# Altium schematic sheet Index.SchDoc: Access Control
size A; DrawnBy: Q.Thang & T.Khoa; Revision: V1.0.1; SheetNumber: 2; SheetTotal: 16
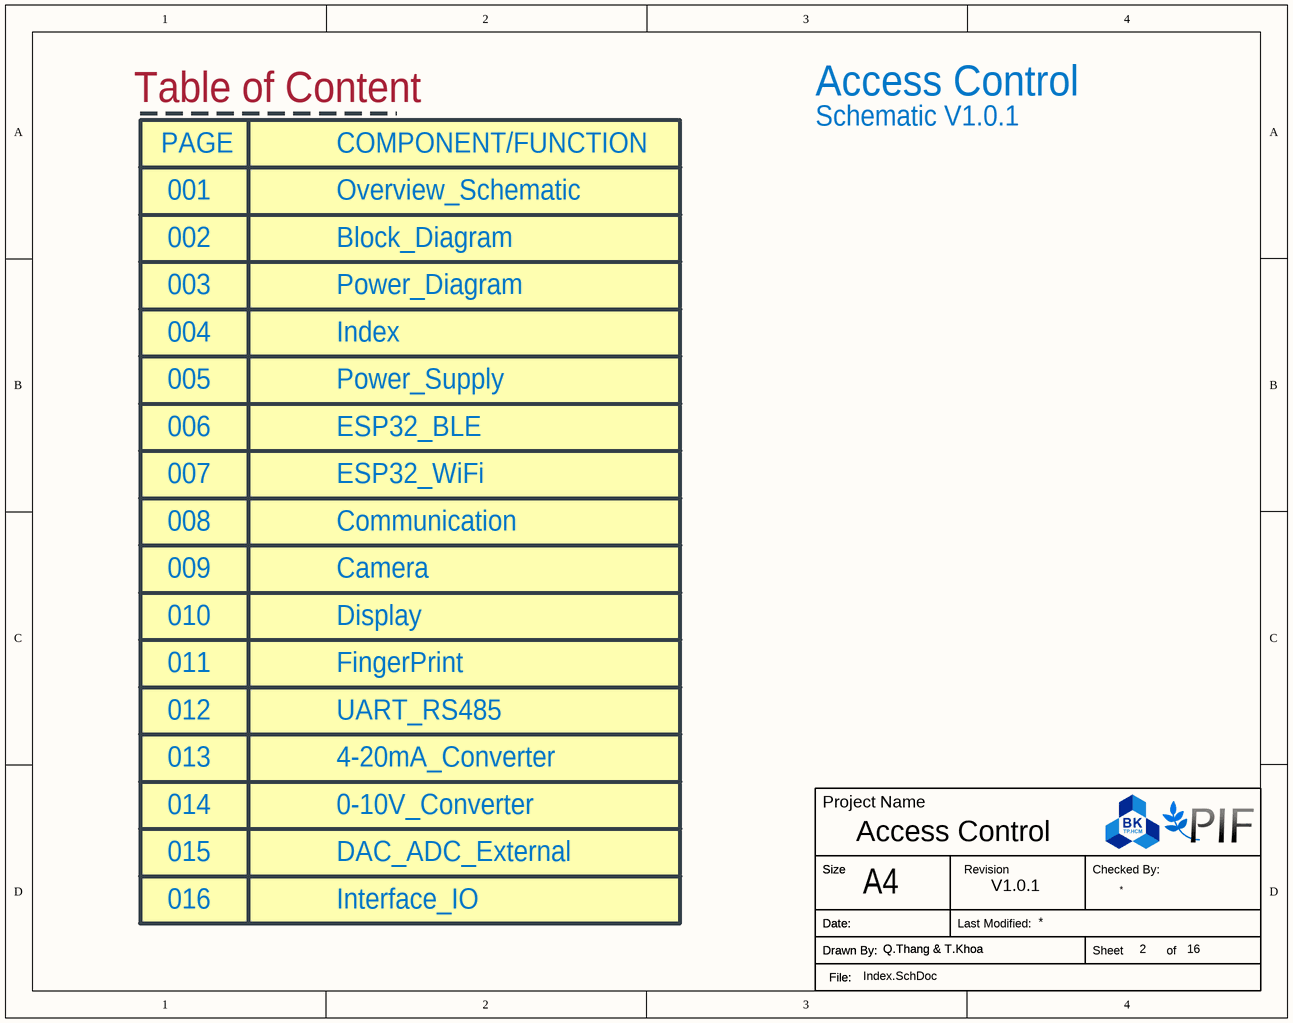
[diagram p0: Index.SchDoc]

## Notes on the sheet
- Access Control
- Table of Content
- PAGE
- COMPONENT/FUNCTION
- Schematic V1.0.1
- 001
- Overview_Schematic
- 002
- 003
- Block_Diagram
- Power_Diagram
- 004
- Index
- 005
- Power_Supply
- 006
- 007
- ESP32_BLE
- ESP32_WiFi
- 008
- Communication
- 009
- 010
- Camera
- Display
- 011
- FingerPrint
- 012
- 013
- UART_RS485
- 4-20mA_Converter
- 014
- 0-10V_Converter
- 015
- 016
- DAC_ADC_External
- Interface_IO
- Project Name
- Size
- A4
- Revision
- Checked By:
- Drawn By:
- Date:
- File:
- Last Modified:
- Sheet
- of